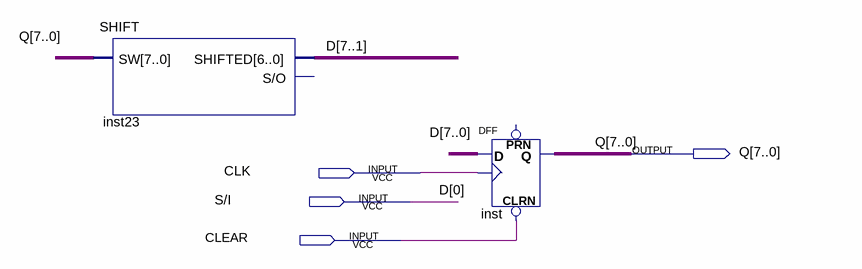
[diagram p0: schematic sheet]
// Quartus schematic SIPO.bdf as structural Verilog: 2 symbols, 4 pins
module SIPO (
  input  CLK,
  input  \S/I ,
  input  CLEAR,
  output [7:0] Q
);

  wire [7:1] D;

  SHIFT inst23 (.SW(Q), .SHIFTED(D));  // open: S/O
  DFF inst[7:0] (.CLRN(CLEAR), .CLK(CLK), .D({D, \S/I }), .Q(Q));  // open: PRN

  // Other names for the same wires on the sheet: D[0] = \S/I 
endmodule
